# EAGLE design HR04_board (EAGLE 8.6.3)
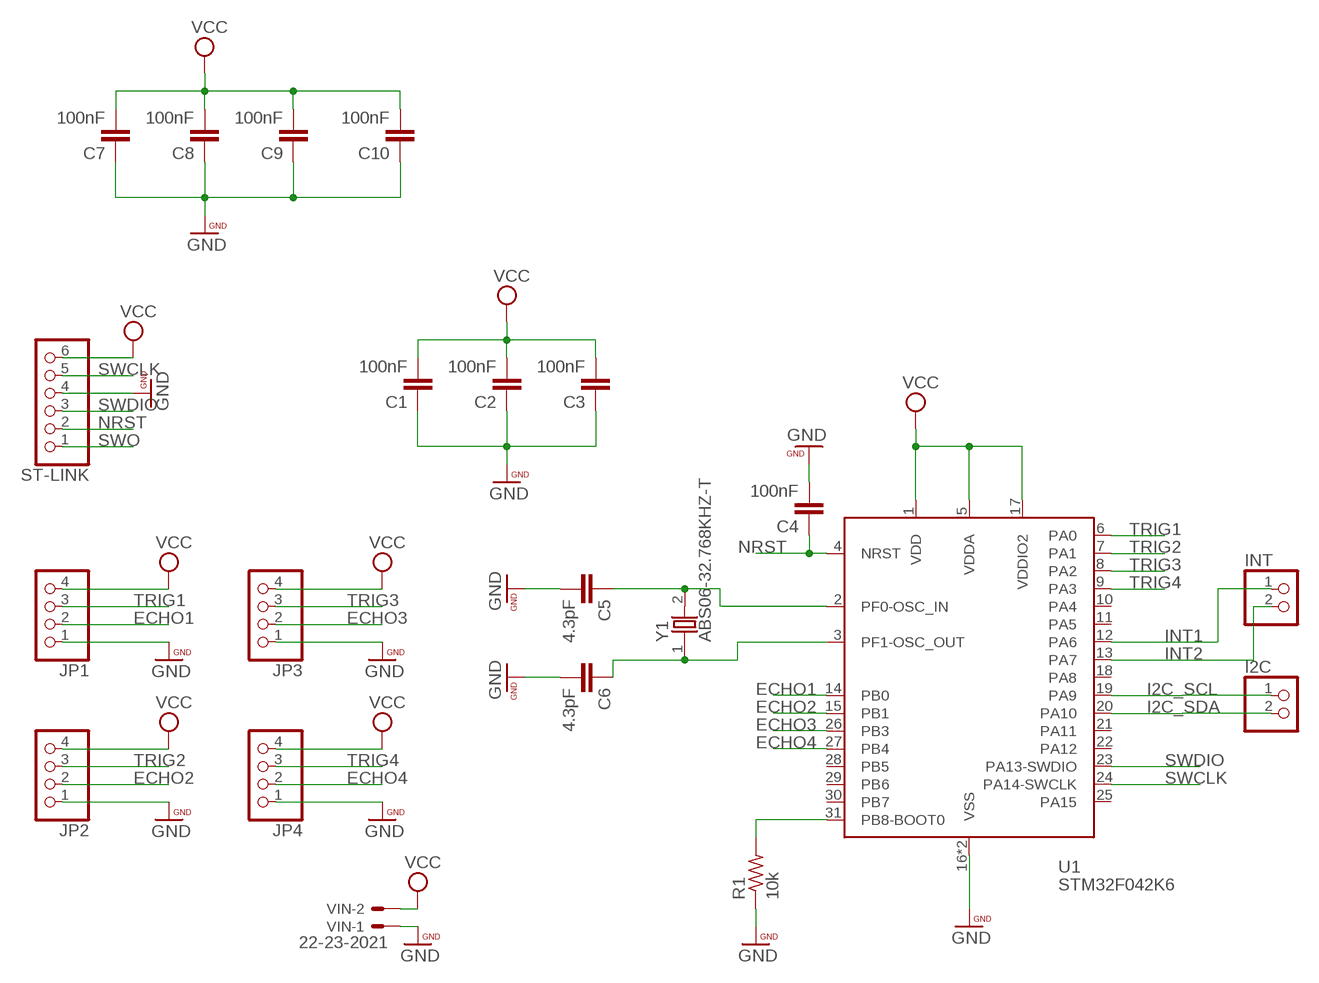
[diagram p0: schematic, sheet 1]

## Parts
C1  100nF  CAP0603-CAP  [0603-CAP]
C2  100nF  CAP0603-CAP  [0603-CAP]
C3  100nF  CAP0603-CAP  [0603-CAP]
C4  100nF  CAP0603-CAP  [0603-CAP]
C5  4.3pF  CAP0402-CAP  [0402-CAP]
C6  4.3pF  CAP0402-CAP  [0402-CAP]
C7  100nF  CAP0603-CAP  [0603-CAP]
C8  100nF  CAP0603-CAP  [0603-CAP]
C9  100nF  CAP0603-CAP  [0603-CAP]
C10  100nF  CAP0603-CAP  [0603-CAP]
I2C  PINHD-1X2  [1X02]
INT  PINHD-1X2  [1X02]
JP1  PINHD-1X4  [1X04]
JP2  PINHD-1X4  [1X04]
JP3  PINHD-1X4  [1X04]
JP4  PINHD-1X4  [1X04]
R1  10k  R-US_R0603  [R0603]
ST-LINK  PINHD-1X6  [1X06]
U1  STM32F042K6  [QFP32-7X7]
VIN  22-23-2021  [22-23-2021]
Y1  ABS06-32.768KHZ-T  [XTAL_ABS06-32.768KHZ-T]

## Nets
ECHO1: JP1.2 U1.14(PB0)
ECHO2: JP2.2 U1.15(PB1)
ECHO3: JP3.2 U1.26(PB3)
ECHO4: JP4.2 U1.27(PB4)
GND: C1.1 C2.1 C3.1 C4.2 C5.2 C6.2 C7.1 C8.1 C9.1 C10.1 JP1.1 JP2.1 JP3.1 JP4.1 R1.1 ST-LINK.4 U1.16(VSS) U1.32(VSS) VIN.1
I2C_SCL: I2C.1 U1.19(PA9)
I2C_SDA: I2C.2 U1.20(PA10)
INT1: INT.1 U1.12(PA6)
INT2: INT.2 U1.13(PA7)
N$1: R1.2 U1.31(PB8-BOOT0)
N$2: C5.1 U1.2(PF0-OSC_IN) Y1.2
N$3: C6.1 U1.3(PF1-OSC_OUT) Y1.1
NRST: C4.1 ST-LINK.2 U1.4(NRST)
SWCLK: ST-LINK.5 U1.24(PA14-SWCLK)
SWDIO: ST-LINK.3 U1.23(PA13-SWDIO)
SWO: ST-LINK.1
TRIG1: JP1.3 U1.6(PA0)
TRIG2: JP2.3 U1.7(PA1)
TRIG3: JP3.3 U1.8(PA2)
TRIG4: JP4.3 U1.9(PA3)
VCC: C1.2 C2.2 C3.2 C7.2 C8.2 C9.2 C10.2 JP1.4 JP2.4 JP3.4 JP4.4 ST-LINK.6 U1.1(VDD) U1.5(VDDA) U1.17(VDDIO2) VIN.2
Unconnected: U1.10(PA4) U1.11(PA5) U1.18(PA8) U1.21(PA11) U1.22(PA12) U1.25(PA15) U1.28(PB5) U1.29(PB6) U1.30(PB7)

## Library data of the parts
C1-C10 = PatternAgents-ProtoPads:CAP: Capacitor Standard 0603 ceramic capacitor, and 0.1" leaded capacitor.
I2C INT = pinhead:PINHD-1X2: PIN HEADER
JP1-JP4 = pinhead:PINHD-1X4: PIN HEADER
R1 = adafruit:R-US_: RESISTOR, American symbol
ST-LINK = pinhead:PINHD-1X6: PIN HEADER
U1 = U-ST-STM32F042K-uC:STM32F042K6
VIN = con-molex:22-23-2021: .100" (2.54mm) Center Header - 2 Pin; MF: MOLEX; MPN: 22-23-2021; OC_FARNELL: 1462926; OC_NEWARK: 25C3832
Y1 = ABS06-32.768KHZ-T:ABS06-32.768KHZ-T: ABS06 Series 32.768 kHz ±10 ppm 12.5 pF -40 to +85 °C SMT Low Profile Crystal; AVAILABILITY: Unavailable; DESCRIPTION: ABS06 Series 32.768 kHz ±20 ppm 12.5 pF -40 to +85 °C SMT Low Profile Crystal; MF: Abracon; MP: ABS06-32.768KHZ-T; PACKAGE: SMD-2 Abracon; PRICE: None

## Board
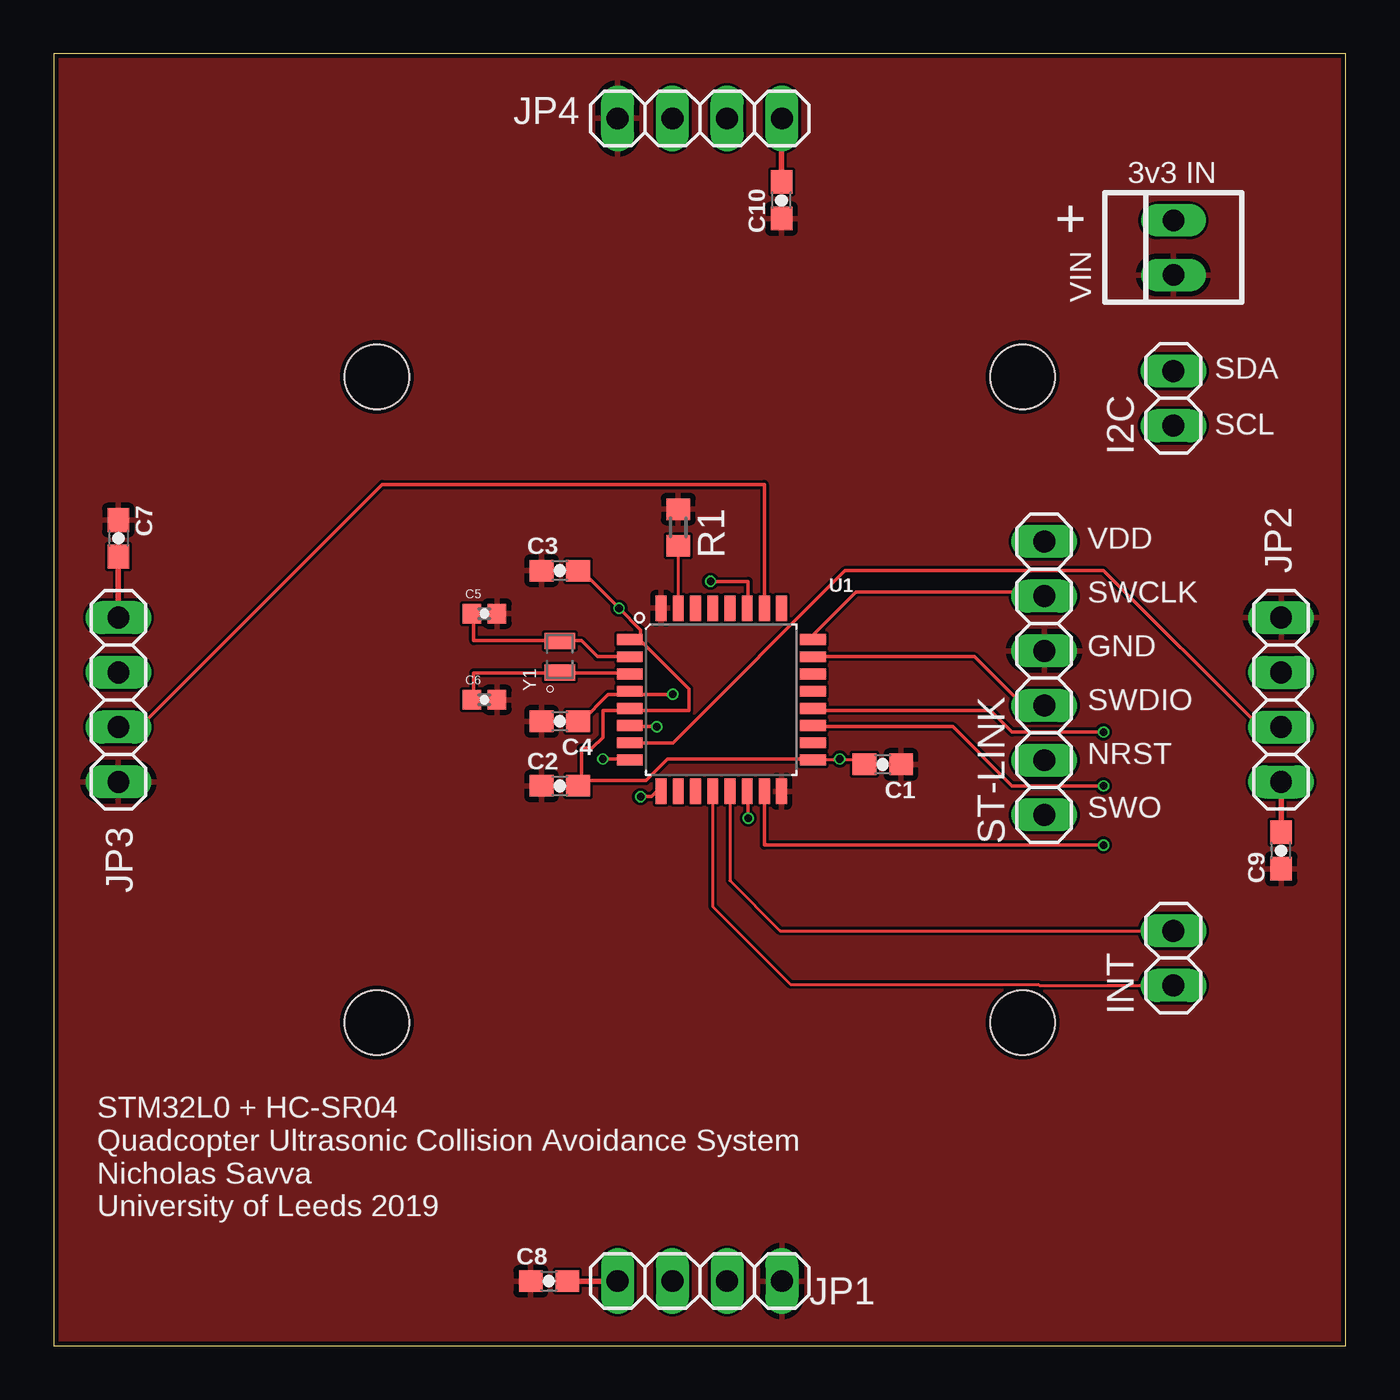
[diagram p1: board, top side]
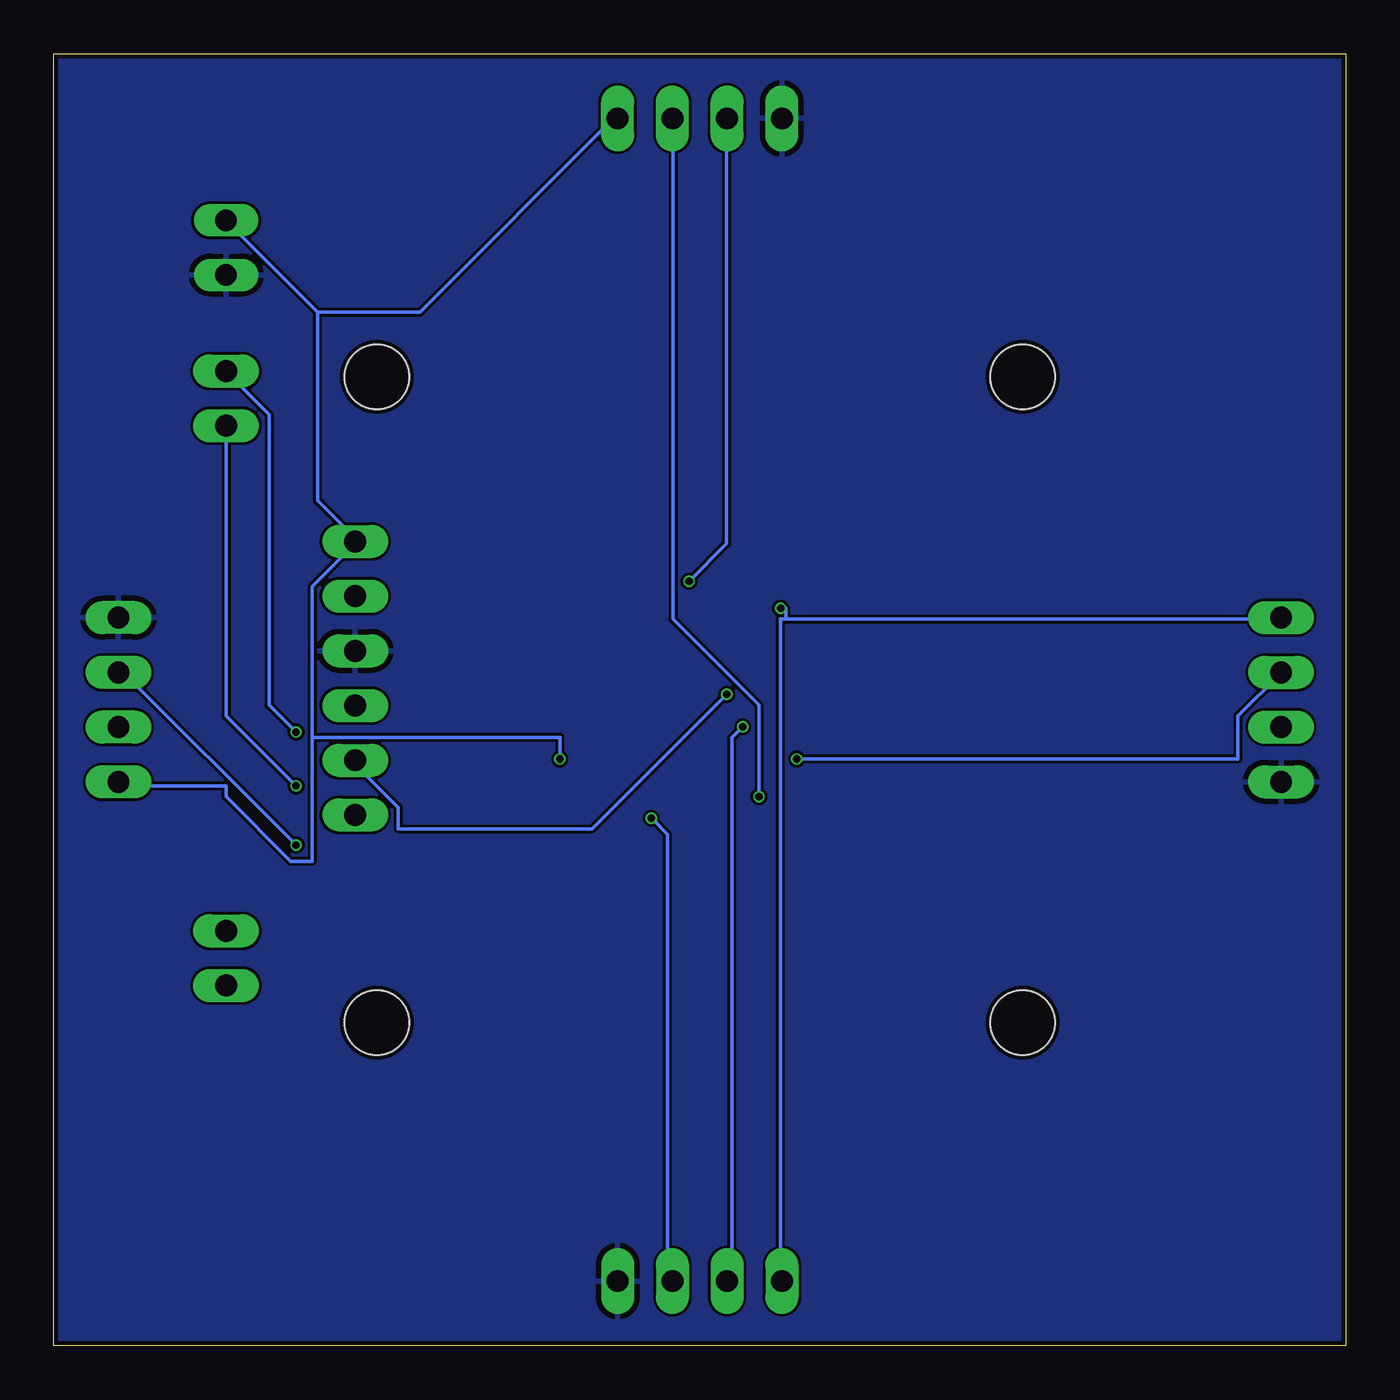
[diagram p2: board, bottom side, seen from below]

Size 60 x 60 mm. Coordinates in mm from the lower left corner, seen from the top.
Outline: 0,0 60,0 60,60 0,60 0,0
Copper layers (1*16): Top 0.035559375mm / dielectric 1.6mm / Bottom 0.035559375mm
Design rules "jlcpcb2layer": minimum track width 5mil, minimum drill 12mil, track to track 5mil, track to pad 5mil, pad to pad 5mil, via to via 5mil, smd to smd 5mil, copper to edge 8mil, drill to drill 6mil, minimum pad ring 5mil, minimum via ring 3mil, stop-mask expansion 2.5mil, vias tented up to drill 0mil, thermal gap 10mil
Holes 3 mm at 15,15 45,15 15,45 45,45

### Footprints (pad centres in the part's own frame; a part is rotated, then mirrored left to right if it is on the bottom)
0603-CAP = smd 1.1 x 1: 1 -0.85,0; 2 0.85,0
0402-CAP = smd 0.85 x 0.9: 1 -0.58,0; 2 0.58,0
1X02 = drill 1.016 long: 1 -1.27,0; 2 1.27,0
1X04 = drill 1.016 long: 1 -3.81,0; 2 -1.27,0; 3 1.27,0; 4 3.81,0
R0603 = smd 1 x 1.1: 1 -0.85,0; 2 0.85,0
1X06 = drill 1.016 long: 1 -6.35,0; 2 -3.81,0; 3 -1.27,0; 4 1.27,0; 5 3.81,0; 6 6.35,0
QFP32-7X7 = smd 1.2 x 0.5: 1 -4.25,2.8; 2 -4.25,2; 3 -4.25,1.2; 4 -4.25,0.4; 5 -4.25,-0.4; 6 -4.25,-1.2; 7 -4.25,-2; 8 -4.25,-2.8; 17 4.25,-2.8; 18 4.25,-2; 19 4.25,-1.2; 20 4.25,-0.4; 21 4.25,0.4; 22 4.25,1.2; 23 4.25,2; 24 4.25,2.8 | smd 0.5 x 1.2: 9 -2.8,-4.25; 10 -2,-4.25; 11 -1.2,-4.25; 12 -0.4,-4.25; 13 0.4,-4.25; 14 1.2,-4.25; 15 2,-4.25; 16 2.8,-4.25; 25 2.8,4.25; 26 2,4.25; 27 1.2,4.25; 28 0.4,4.25; 29 -0.4,4.25; 30 -1.2,4.25; 31 -2,4.25; 32 -2.8,4.25
22-23-2021 = drill 1 long: 1 -1.27,0; 2 1.27,0
XTAL_ABS06-32.768KHZ-T = smd 0.75 x 1.4: 1 -0.73,0; 2 0.73,0

### Placement (x,y rotation side)
C1  38.5,27 180 top
C2  23.5,26 0 top
C3  23.5,36 0 top
C4  23.5,29 180 top
C5  20,34 0 top
C6  20,30 0 top
C7  3,37.5 270 top
C8  23,3 0 top
C9  57,23 90 top
C10  33.8,53.2 90 top
I2C  52,44 90 top
INT  52,18 90 top
JP1  30,3 180 top
JP2  57,30 270 top
JP3  3,30 90 top
JP4  30,57 0 top
R1  29,38 270 top
ST-LINK  46,31 90 top
U1  31,30 0 top
VIN  52,51 90 top
Y1  23.5,32 90 top

### Tracks (layer width: path | path; a pad name or v marks a point on that pad's centre or on a via)
ECHO1  (via drill 0.35)
  Top 0.152: v32.25,24.5 32.25,25.75 U1.14
  Bottom 0.152: v32.25,24.5 31.5,23.75 31.5,3 JP1.2
ECHO2  (via drill 0.35)
  Top 0.152: U1.15 33,23.25 v48.75,23.25
  Bottom 0.152: v48.75,23.25 57,31.5 JP2.2
ECHO3
  Top 0.152: U1.26 33,40 15.25,40 4,28.75 3,28.75 JP3.2
ECHO4  (via drill 0.35)
  Top 0.152: v30.5,35.5 32.25,35.5 32.25,34.25 U1.27
  Bottom 0.152: v30.5,35.5 28.75,37.25 28.75,57 JP4.2
GND
  pour Top: 0,0 60,0 60,60 0,60
  pour Bottom: 0,0 60,0 60,60 0,60
I2C_SCL  (via drill 0.35)
  Top 0.152: v48.75,26 44.5,26 41.75,28.75 35.25,28.75 U1.19
  Bottom 0.152: v48.75,26 52,29.25 52,42.5 I2C.1
I2C_SDA  (via drill 0.35)
  Top 0.152: v48.75,28.5 44.5,28.5 43.5,29.5 35.25,29.5 U1.20
  Bottom 0.152: v48.75,28.5 50,29.75 50,43.25 52,45.25 I2C.2
INT1
  Top 0.15: U1.12 30.6,20.4 34.22,16.78 45.74,16.78 45.78,16.73 INT.1
INT2
  Top 0.15: U1.13 31.4,21.6 33.73,19.27 INT.2
N$1
  Top 0.15: R1.2 U1.31
N$2
  Top 0.152: 23.5,32.75 19.5,32.75 19.5,34 C5.1 | 23.5,32.75 Y1.2 23.5,32.75 | U1.2 25.25,32 24.5,32.75 23.5,32.75
N$3
  Top 0.152: 23.5,31.25 19.5,31.25 19.5,30 C6.1 | 23.5,31.25 Y1.1 23.5,31.25 | 23.5,31.25 26.75,31.25 U1.3
NRST  (via drill 0.35)
  Top 0.152: 26.75,30.25 25.75,30.25 24.5,29 C4.1 | 26.75,30.25 U1.4 26.75,30.25 | v28.75,30.25 26.75,30.25
  Bottom 0.152: v28.75,30.25 35,24 44,24 44,25 46,27 ST-LINK.2
SWCLK
  Top 0.152: U1.24 35.25,33 37.25,35 46,35 ST-LINK.5
SWDIO
  Top 0.152: U1.23 42.75,32 45,29.75 46,29.75 ST-LINK.3
TRIG1  (via drill 0.35)
  Top 0.152: v28,28.75 26.75,28.75 U1.6
  Bottom 0.152: v28,28.75 28.5,28.25 28.5,3 JP1.3
TRIG2
  Top 0.152: U1.7 28.75,28 36.75,36 48.75,36 56,28.75 57,28.75 JP2.3
TRIG3  (via drill 0.35)
  Top 0.152: v25.5,27.25 26.75,27.25 U1.8
  Bottom 0.152: v25.5,27.25 5,27.25 5,29.25 3,31.25 JP3.3
TRIG4  (via drill 0.35)
  Top 0.152: v27.25,25.5 27.75,25.5 28,25.75 U1.9
  Bottom 0.152: v27.25,25.5 27.25,29.75 31.25,33.75 31.25,57 JP4.3
VCC  (via drill 0.35)
  Top 0.15: C1.2 37.45,27.2 36.5,27.2 U1.17 | 26.55,33 U1.1
  Top 0.152: 27.25,32.75 27.25,33.25 v26.25,34.25 24.5,36 C3.2 | 27.25,32.75 26.75,32.75 U1.1 27.25,32.75 | 24.5,26.25 24.5,27.75 25,27.75 25.5,28.25 25.5,29.5 26.75,29.5 | 24.5,26.25 24.5,26 C2.2 24.5,26.25 | 26.75,29.5 U1.5 26.75,29.5 | 24.5,26.25 27.5,26.25 28.5,27.25 35.25,27.25 U1.17 | 27.25,32.75 29.5,30.5 29.5,29.5 26.75,29.5 | v36.5,27.25 36.5,27.2
  Top 0.254: C9.2 JP2.4 | C10.2 JP4.4 | C7.2 JP3.4 | C8.2 JP1.4
  Bottom 0.152: 47.75,48 52,52.25 VIN.2 | 47.75,48 47.75,39.25 46,37.5 ST-LINK.6 46,37.25 48,35.25 48,28.25 | 47.75,48 43,48 34,57 JP4.4 | 48,28.25 48,22.5 49,22.5 52,25.5 52,26 57,26 JP2.4 | 26,33.75 26.25,33.75 26.25,3 JP1.4 | 26,33.75 3,33.75 JP3.4 | v26.25,34.25 26,34.25 26,33.75 | 48,28.25 36.5,28.25 v36.5,27.25

### Text on the board
tPlace: 3v3 IN | + | SDA | SCL | VDD | SWCLK | GND | SWDIO | NRST | SWO | STM32L0 + HC-SR04 / Quadcopter Ultrasonic Collision Avoidance System / Nicholas Savva / University of Leeds 2019